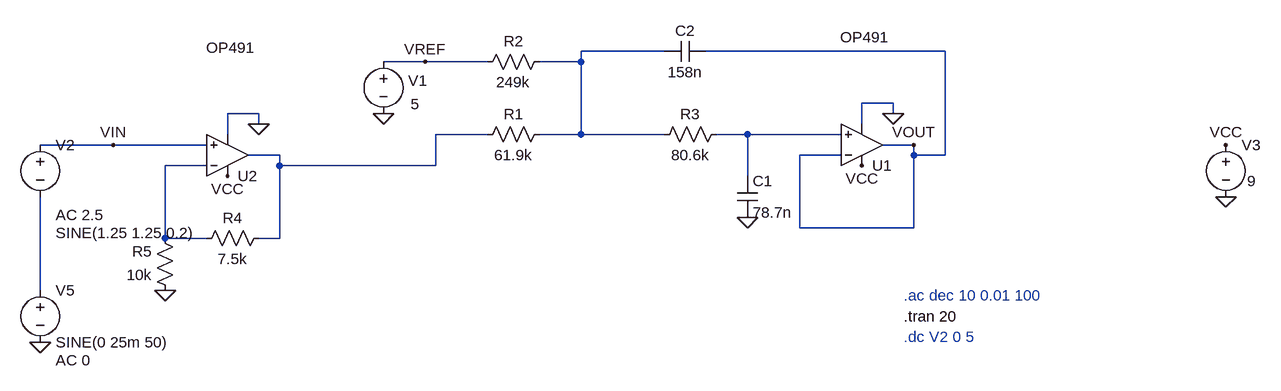
[diagram p0: schematic RRFilter1.asc]
RRFilter1.asc, the LTspice schematic file:
Version 4
SHEET 1 904 680
WIRE -16 16 -144 16
WIRE 416 16 48 16
WIRE -384 32 -448 32
WIRE -288 32 -384 32
WIRE -144 32 -144 16
WIRE -144 32 -208 32
WIRE 336 96 288 96
WIRE -640 112 -688 112
WIRE 336 112 336 96
WIRE -640 128 -640 112
WIRE 288 128 288 96
WIRE -688 144 -688 112
WIRE -288 144 -368 144
WIRE -144 144 -144 32
WIRE -144 144 -208 144
WIRE -16 144 -144 144
WIRE 112 144 64 144
WIRE 256 144 112 144
WIRE -864 160 -976 160
WIRE -720 160 -864 160
WIRE 368 160 320 160
WIRE -608 176 -656 176
WIRE 256 176 192 176
WIRE 368 176 368 160
WIRE 416 176 416 16
WIRE 416 176 368 176
WIRE -720 192 -784 192
WIRE -608 192 -608 176
WIRE -368 192 -368 144
WIRE -368 192 -608 192
WIRE 112 208 112 144
WIRE 192 288 192 176
WIRE 368 288 368 176
WIRE 368 288 192 288
WIRE -784 304 -784 192
WIRE -720 304 -784 304
WIRE -608 304 -608 192
WIRE -608 304 -640 304
WIRE -976 384 -976 240
FLAG 336 112 0
FLAG -448 112 0
FLAG 848 240 0
FLAG 848 160 VCC
FLAG 288 192 VCC
FLAG 368 160 VOUT
FLAG -864 160 VIN
FLAG -384 32 VREF
FLAG 112 272 0
FLAG -976 464 0
FLAG -640 128 0
FLAG -688 208 VCC
FLAG -784 384 0
SYMBOL res -192 16 R90
WINDOW 0 0 56 VBottom 2
WINDOW 3 32 56 VTop 2
SYMATTR InstName R2
SYMATTR Value 249k
SYMBOL res -192 128 R90
WINDOW 0 0 56 VBottom 2
WINDOW 3 32 56 VTop 2
SYMATTR InstName R1
SYMATTR Value 61.9k
SYMBOL voltage -448 16 R0
WINDOW 0 38 45 Left 2
WINDOW 3 42 81 Left 2
WINDOW 123 0 0 Left 0
WINDOW 39 0 0 Left 0
SYMATTR InstName V1
SYMATTR Value 5
SYMBOL voltage 848 144 R0
WINDOW 3 33 72 Left 2
WINDOW 123 0 0 Left 0
WINDOW 39 0 0 Left 0
SYMATTR Value 9
SYMATTR InstName V3
SYMBOL OpAmps\\OP491 288 224 M180
WINDOW 3 -33 230 Left 2
SYMATTR InstName U1
SYMBOL cap 96 208 R0
SYMATTR InstName C1
SYMATTR Value 78.7n
SYMBOL res 80 128 R90
WINDOW 0 0 56 VBottom 2
WINDOW 3 32 56 VTop 2
SYMATTR InstName R3
SYMATTR Value 80.6k
SYMBOL cap 48 0 R90
WINDOW 0 0 32 VBottom 2
WINDOW 3 32 32 VTop 2
SYMATTR InstName C2
SYMATTR Value 158n
SYMBOL voltage -976 144 R0
WINDOW 3 24 152 Left 2
WINDOW 123 24 124 Left 2
WINDOW 39 0 0 Left 0
SYMATTR Value SINE(1.25 1.25 0.2)
SYMATTR Value2 AC 2.5
SYMATTR InstName V2
SYMBOL voltage -976 368 R0
WINDOW 123 24 124 Left 2
WINDOW 39 0 0 Left 0
SYMATTR Value2 AC 0
SYMATTR InstName V5
SYMATTR Value SINE(0 25m 50)
SYMBOL OpAmps\\OP491 -688 240 M180
WINDOW 3 -33 230 Left 2
SYMATTR InstName U2
SYMBOL res -624 288 R90
WINDOW 0 0 56 VBottom 2
WINDOW 3 32 56 VTop 2
SYMATTR InstName R4
SYMATTR Value 7.5k
SYMBOL res -768 400 R180
WINDOW 0 36 76 Left 2
WINDOW 3 36 40 Left 2
SYMATTR InstName R5
SYMATTR Value 10k
TEXT 352 392 Left 2 ;.ac dec 10 0.01 100
TEXT 352 424 Left 2 !.tran 20
TEXT 352 456 Left 2 ;.dc V2 0 5

The netlist it stands for:
* RRFilter1.asc
R2 N001 VREF 249k
R1 N001 N002 61.9k
V1 VREF 0 5
V3 VCC 0 9
XU1 N003 VOUT VCC 0 VOUT OP491  ; pins In+ In- V+ V- OUT
C1 N003 0 78.7n
R3 N003 N001 80.6k
C2 VOUT N001 158n
V2 VIN N005 SINE(1.25 1.25 0.2) AC 2.5
V5 N005 0 SINE(0 25m 50) AC 0
XU2 VIN N004 VCC 0 N002 OP491  ; pins In+ In- V+ V- OUT
R4 N002 N004 7.5k
R5 0 N004 10k
* .ac dec 10 0.01 100
.tran 20
* .dc V2 0 5
.backanno
.end